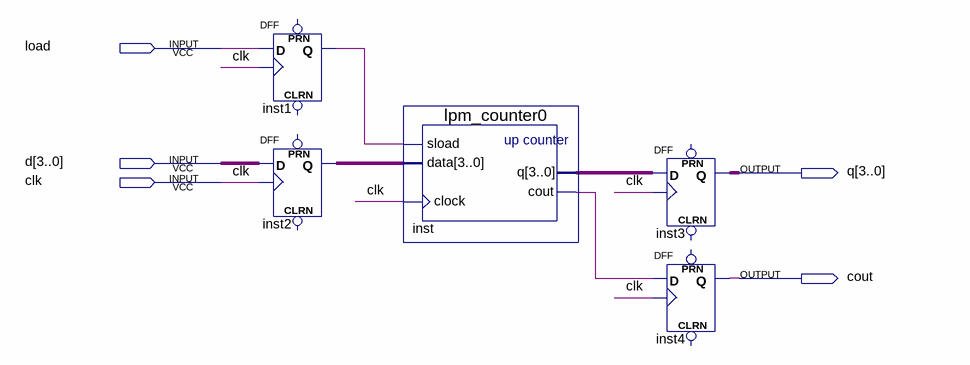
[diagram p0: schematic sheet]
// Quartus schematic lab3.bdf as structural Verilog: 5 symbols, 5 pins
module lab3 (
  input  load,
  input  [3:0] d,
  input  clk,
  output [3:0] q,
  output cout
);

  wire inst1_q, inst_cout;
  wire [3:0] inst2_q, inst_q;

  DFF inst1 (.CLK(clk), .D(load), .Q(inst1_q));  // open: CLRN, PRN
  DFF inst2[3:0] (.CLK(clk), .D(d), .Q(inst2_q));  // open: CLRN, PRN
  lpm_counter0 inst (.sload(inst1_q), .data(inst2_q), .clock(clk), .cout(inst_cout), .q(inst_q));
  DFF inst3[3:0] (.CLK(clk), .D(inst_q), .Q(q));  // open: CLRN, PRN
  DFF inst4 (.CLK(clk), .D(inst_cout), .Q(cout));  // open: CLRN, PRN
endmodule
